# EAGLE design MainBoard_V5 (EAGLE 6.1)
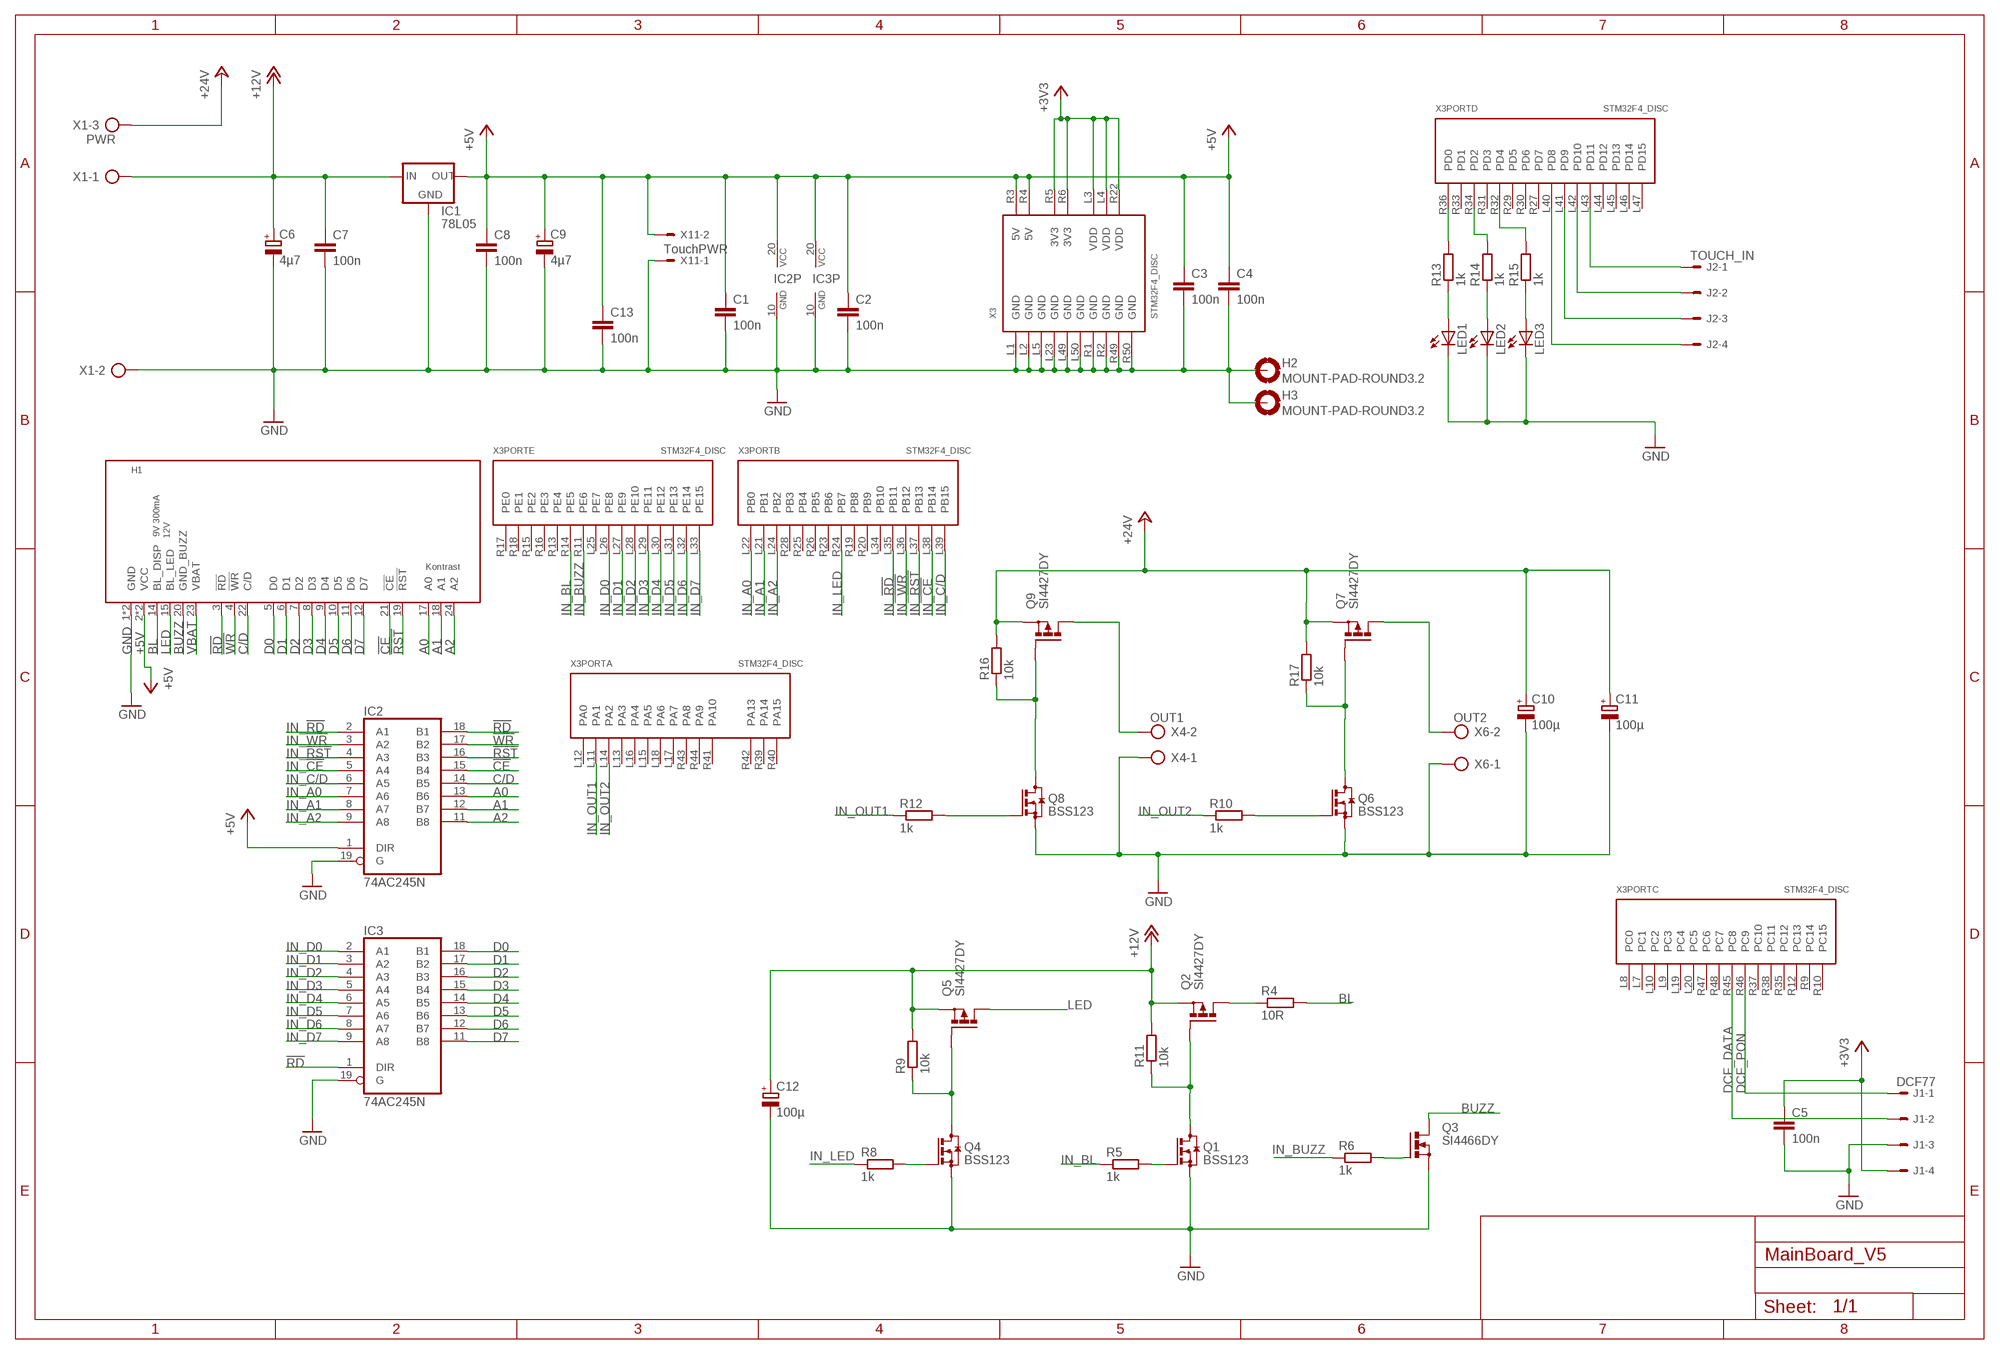
[diagram p0: schematic, sheet 1]

## Parts
C1  100n  C-EUC1206  [C1206]
C2  100n  C-EUC1206  [C1206]
C3  100n  C-EUC1206  [C1206]
C4  100n  C-EUC1206  [C1206]
C5  100n  C-EUC1206  [C1206]
C6  4µ7  CPOL-EUE2-5  [E2-5]
C7  100n  C-EUC1206  [C1206]
C8  100n  C-EUC1206  [C1206]
C9  4µ7  CPOL-EUE2-5  [E2-5]
C10  100µ  CPOL-EUE2-5  [E2-5]
C11  100µ  CPOL-EUE2-5  [E2-5]
C12  100µ  CPOL-EUE2-5  [E2-5]
C13  100n  C-EUC1206  [C1206]
H1  YL_24012-70-MICROMATCH  [YL24012-70-MICROMATCH]
H2  MOUNT-PAD-ROUND3.2  [3,2-PAD]
H3  MOUNT-PAD-ROUND3.2  [3,2-PAD]
IC1  78L05  78XXS  [78XXS]
IC2  74AC245N  [DIL20]
IC3  74AC245N  [DIL20]
J1  DCF77  22-27-2041-04  [6410-04]
J2  TOUCH_IN  22-27-2041-04  [6410-04]
LED1  LED3MM  [LED3MM]
LED2  LED3MM  [LED3MM]
LED3  LED3MM  [LED3MM]
Q1  BSS123  [SOT23]
Q2  SI4427DY  P-MOSFET-SO8  [SO-08]
Q3  SI4466DY  N-MOSFET-SO8S  [SO-08]
Q4  BSS123  [SOT23]
Q5  SI4427DY  P-MOSFET-SO8  [SO-08]
Q6  BSS123  [SOT23]
Q7  SI4427DY  P-MOSFET-SO8  [SO-08]
Q8  BSS123  [SOT23]
Q9  SI4427DY  P-MOSFET-SO8  [SO-08]
R4  10R  R-EU_0414/15  [0414/15]
R5  1k  R-EU_0207/10  [0207/10]
R6  1k  R-EU_R0805  [R0805]
R8  1k  R-EU_0207/10  [0207/10]
R9  10k  R-EU_0207/10  [0207/10]
R10  1k  R-EU_0207/10  [0207/10]
R11  10k  R-EU_0207/10  [0207/10]
R12  1k  R-EU_0207/10  [0207/10]
R13  1k  R-EU_0207/10  [0207/10]
R14  1k  R-EU_0207/10  [0207/10]
R15  1k  R-EU_0207/10  [0207/10]
R16  10k  R-EU_R1206  [R1206]
R17  10k  R-EU_R1206  [R1206]
X1  PWR  AK500/3  [AK500/3]
X3  STM32F4_DISC  [STM32F4_DISC]
X4  OUT1  AK500/2  [AK500/2]
X6  OUT2  AK500/2  [AK500/2]
X11  TouchPWR  22-23-2021  [22-23-2021]

## Nets
!CE: H1.21(!CE) IC2.15(B4)
!RD: H1.3(!RD) IC2.18(B1) IC3.1(DIR)
!RST: H1.19(!RST) IC2.16(B3)
!WR: H1.4(!WR) IC2.17(B2)
+3V3: C5.1 J1.4 X3.L3(VDD) X3.L4(VDD) X3.R5(3V3) X3.R6(3V3) X3.R22(VDD)
+5V: C1.1 C2.1 C3.1 C4.1 C8.1 C9.+ C13.1 H1.2(VCC) H1.16(VCC) IC1.OUT IC2.1(DIR) IC2.20(VCC) IC3.20(VCC) X3.R3(5V) X3.R4(5V) X11.2
+12V: C6.+ C7.1 C12.+ IC1.IN Q2.1(S) Q2.2(S) Q2.3(S) Q5.1(S) Q5.2(S) Q5.3(S) R9.2 R11.2 X1.1
+24V: C10.+ C11.+ Q7.1(S) Q7.2(S) Q7.3(S) Q9.1(S) Q9.2(S) Q9.3(S) R16.2 R17.2 X1.3
A0: H1.17(A0) IC2.13(B6)
A1: H1.18(A1) IC2.12(B7)
A2: H1.24(A2) IC2.11(B8)
BL: H1.14(BL_DISP) R4.2
BUZZ: H1.20(GND_BUZZ) Q3.5(D) Q3.6(D) Q3.7(D) Q3.8(D)
C/D: H1.22(C/D) IC2.14(B5)
D0: H1.5(D0) IC3.18(B1)
D1: H1.6(D1) IC3.17(B2)
D2: H1.7(D2) IC3.16(B3)
D3: H1.8(D3) IC3.15(B4)
D4: H1.9(D4) IC3.14(B5)
D5: H1.10(D5) IC3.13(B6)
D6: H1.11(D6) IC3.12(B7)
D7: H1.12(D7) IC3.11(B8)
DCF_DATA: J1.2 X3.R45(PC8)
DCF_PON: J1.1 X3.R46(PC9)
GND: C1.2 C2.2 C3.2 C4.2 C5.2 C6.- C7.2 C8.2 C9.- C10.- C11.- C12.- C13.2 H1.1(GND) H1.13(GND) H2.B3,2(MOUNT) H3.B3,2(MOUNT) IC1.GND IC2.10(GND) IC2.19(G) IC3.10(GND) IC3.19(G) J1.3 LED1.K(C) LED2.K(C) LED3.K(C) Q1.2(S) Q3.1(S) Q3.2(S) Q3.3(S) Q4.2(S) Q6.2(S) Q8.2(S) X1.2 X3.L1(GND) X3.L2(GND) X3.L5(GND) X3.L23(GND) X3.L49(GND) X3.L50(GND) X3.R1(GND) X3.R2(GND) X3.R49(GND) X3.R50(GND) X4.1 X6.1 X11.1
IN_!CE: IC2.5(A4) X3.L38(PB14)
IN_!RD: IC2.2(A1) X3.L35(PB11)
IN_!RST: IC2.4(A3) X3.L37(PB13)
IN_!WR: IC2.3(A2) X3.L36(PB12)
IN_A0: IC2.7(A6) X3.L22(PB0)
IN_A1: IC2.8(A7) X3.L21(PB1)
IN_A2: IC2.9(A8) X3.L24(PB2)
IN_BL: R5.1 X3.R14(PE5)
IN_BUZZ: R6.1 X3.R11(PE6)
IN_C/D: IC2.6(A5) X3.L39(PB15)
IN_D0: IC3.2(A1) X3.L26(PE8)
IN_D1: IC3.3(A2) X3.L27(PE9)
IN_D2: IC3.4(A3) X3.L28(PE10)
IN_D3: IC3.5(A4) X3.L29(PE11)
IN_D4: IC3.6(A5) X3.L30(PE12)
IN_D5: IC3.7(A6) X3.L31(PE13)
IN_D6: IC3.8(A7) X3.L32(PE14)
IN_D7: IC3.9(A8) X3.L33(PE15)
IN_LED: R8.1 X3.R24(PB7)
IN_OUT1: R12.1 X3.L11(PA1)
IN_OUT2: R10.1 X3.L14(PA2)
LED: H1.15(BL_LED) Q5.5(D) Q5.6(D) Q5.7(D) Q5.8(D)
N$1: R15.2 X3.R32(PD4)
N$2: R14.2 X3.R34(PD2)
N$3: J2.1 X3.L43(PD11)
N$4: Q1.3(D) Q2.4(G) R11.1
N$5: Q2.5(D) Q2.6(D) Q2.7(D) Q2.8(D) R4.1
N$6: Q1.1(G) R5.2
N$7: Q4.3(D) Q5.4(G) R9.1
N$8: Q3.4(G) R6.2
N$9: J2.2 X3.L42(PD10)
N$10: J2.3 X3.L41(PD9)
N$11: Q4.1(G) R8.2
N$12: Q6.3(D) Q7.4(G) R17.1
N$13: Q6.1(G) R10.2
N$14: J2.4 X3.L40(PD8)
N$15: Q8.3(D) Q9.4(G) R16.1
N$16: Q8.1(G) R12.2
N$17: LED1.A R13.1
N$18: LED2.A R14.1
N$19: LED3.A R15.1
N$28: R13.2 X3.R36(PD0)
OUT1: Q9.5(D) Q9.6(D) Q9.7(D) Q9.8(D) X4.2
OUT2: Q7.5(D) Q7.6(D) Q7.7(D) Q7.8(D) X6.2
VBAT: H1.23(VBAT)
Unconnected: X3.L6(!RST) X3.L7(PC1) X3.L8(PC0) X3.L9(PC3) X3.L10(PC2) X3.L12(PA0) X3.L13(PA3) X3.L15(PA5) X3.L16(PA4) X3.L17(PA7) X3.L18(PA6) X3.L19(PC4) X3.L20(PC5) X3.L25(PE7) X3.L34(PB10) X3.L44(PD12) X3.L45(PD13) X3.L46(PD14) X3.L47(PD15) X3.L48(NC) X3.R7(PH0) X3.R8(PH1) X3.R9(PC14) X3.R10(PC15) X3.R12(PC13) X3.R13(PE4) X3.R15(PE2) X3.R16(PE3) X3.R17(PE0) X3.R18(PE1) X3.R19(PB8) X3.R20(PB9) X3.R21(BOOT0) X3.R23(PB6) X3.R25(PB4) X3.R26(PB5) X3.R27(PD7) X3.R28(PB3) X3.R29(PD5) X3.R30(PD6) X3.R31(PD3) X3.R33(PD1) X3.R35(PC12) X3.R37(PC10) X3.R38(PC11) X3.R39(PA14) X3.R40(PA15) X3.R41(PA10) X3.R42(PA13) X3.R43(PA8) X3.R44(PA9) X3.R47(PC6) X3.R48(PC7) X3.T1(JP2A) X3.T2(JP2B) X3.T3(JP3A) X3.T4(JP3B)

## Library data of the parts
C1-C5 C7 C8 C13 = rcl:C-EU: CAPACITOR, European symbol
C6 C9-C12 = rcl:CPOL-EU: POLARIZED CAPACITOR, European symbol
H1 = GLCD-YL240:YL_24012-70-MICROMATCH
H2 H3 = holes:MOUNT-PAD-ROUND: MOUNTING PAD, round
IC1 = v-reg:78XXS: VOLTAGE REGULATOR
IC2 IC3 = 74xx-eu:74*245: Octal BUS TRANSCEIVER, 3-state
J1 J2 = con-molex:22-?-04: CONNECTOR wire to board 2.54 mm (.1 inch) pitch header; OC_FARNELL: unknown; OC_NEWARK: unknown
LED1-LED3 = led:LED: LED OSRAM: - CHIPLED LG R971, LG N971, LY N971, LG Q971, LY Q971, LO R971, LY R971 LH N974, LH R974 LS Q976, LO Q976, LY Q976 LO Q996 - Hyper CHIPLED LW Q18S LB Q993, LB Q99A, LB R99A - SideLED LS A670, LO A670, LY A670, LG A670, LP A670 LB A673, LV A673, LT A673, LW A673 LH A674 LY A675 LS A676, LA A676, LO A676, LY A676, LW A676 LS A679, LY A679, LG A679 - Hyper Micro SIDELED® LS Y876, LA Y876, LO Y876, LY Y876 LT Y87S - SmartLED LW L88C, LW L88S LB L89C, LB L89S, LG L890 LS L89K, LO L89K, LY L89K LS L896, LA L896, LO L896, LY L896 - TOPLED LS T670, LO T670, LY T670, LG T670, LP T670 LSG T670, LSP T670, LSY T670, LOP T670, LYG T670 LG T671, LOG T671, LSG T671 LB T673, LV T673, LT T673, LW T673 LH T674 LS T676, LA T676, LO T676, LY T676, LB T676, LH T676, LSB T676, LW T676 LB T67C, LV T67C, LT T67C, LS T67K, LO T67K, LY T67K, LW E67C LS E67B, LA E67B, LO E67B, LY E67B, LB E67C, LV E67C, LT E67C LW T67C LS T679, LY T679, LG T679 LS T770, LO T770, LY T770, LG T770, LP T770 LB T773, LV T773, LT T773, LW T773 LH T774 LS E675, LA E675, LY E675, LS T675 LS T776, LA T776, LO T776, LY T776, LB T776 LHGB T686 LT T68C, LB T68C - Hyper Mini TOPLED® LB M676 - Mini TOPLED Santana® LG M470 LS M47K, LO M47K, LY M47K Source: http://www.osram.convergy.de LUXEON: - LUMILED® LXK2-PW12-R00, LXK2-PW12-S00, LXK2-PW14-U00, LXK2-PW14-V00 LXK2-PM12-R00, LXK2-PM12-S00, LXK2-PM14-U00 LXK2-PE12-Q00, LXK2-PE12-R00, LXK2-PE12-S00, LXK2-PE14-T00, LXK2-PE14-U00 LXK2-PB12-K00, LXK2-PB12-L00, LXK2-PB12-M00, LXK2-PB14-N00, LXK2-PB14-P00, LXK2-PB14-Q00 LXK2-PR12-L00, LXK2-PR12-M00, LXK2-PR14-Q00, LXK2-PR14-R00 LXK2-PD12-Q00, LXK2-PD12-R00, LXK2-PD12-S00 LXK2-PH12-R00, LXK2-PH12-S00 LXK2-PL12-P00, LXK2-PL12-Q00, LXK2-PL12-R00 Source: www.luxeon.com KINGBRIGHT: KA-3528ASYC Source: www.kingbright.com
Q1 Q4 Q6 Q8 = transistor-small-signal:BSS123: N-CHANNEL MOS FET
Q2 Q5 Q7 Q9 = transistor-power:P-MOSFET-SO8: P-Channel MOSFET Example: FDS4435A; P-Channel Logic Level PowerTrench® MOSFET FDS4465; P-Channel 1.8V Specified PowerTrench® MOSFET Source: www.fairchildsemi.com
Q3 = transistor-power:N-MOSFET-SO8: N-Channel MOSFET Example: FDS7760A; N-Channel Logic Level PowerTrench® MOSFET FDS2572; N-Channel UltraFET® Trench MOSFET Source: www.fairchildsemi.com
R4-R6 R8-R17 = rcl:R-EU_: RESISTOR, European symbol
X1 = con-ptr500:AK500/3: CONNECTOR; OC_FARNELL: unknown; OC_NEWARK: unknown
X3 = stm32f4_disc:STM32F4_DISC: STM32F4 Discovery Board
X4 X6 = con-ptr500:AK500/2: CONNECTOR; OC_FARNELL: unknown; OC_NEWARK: unknown
X11 = con-molex:22-23-2021: .100" (2.54mm) Center Header - 2 Pin; MF: MOLEX; MPN: 22-23-2021; OC_FARNELL: 1462926; OC_NEWARK: 25C3832

## Board
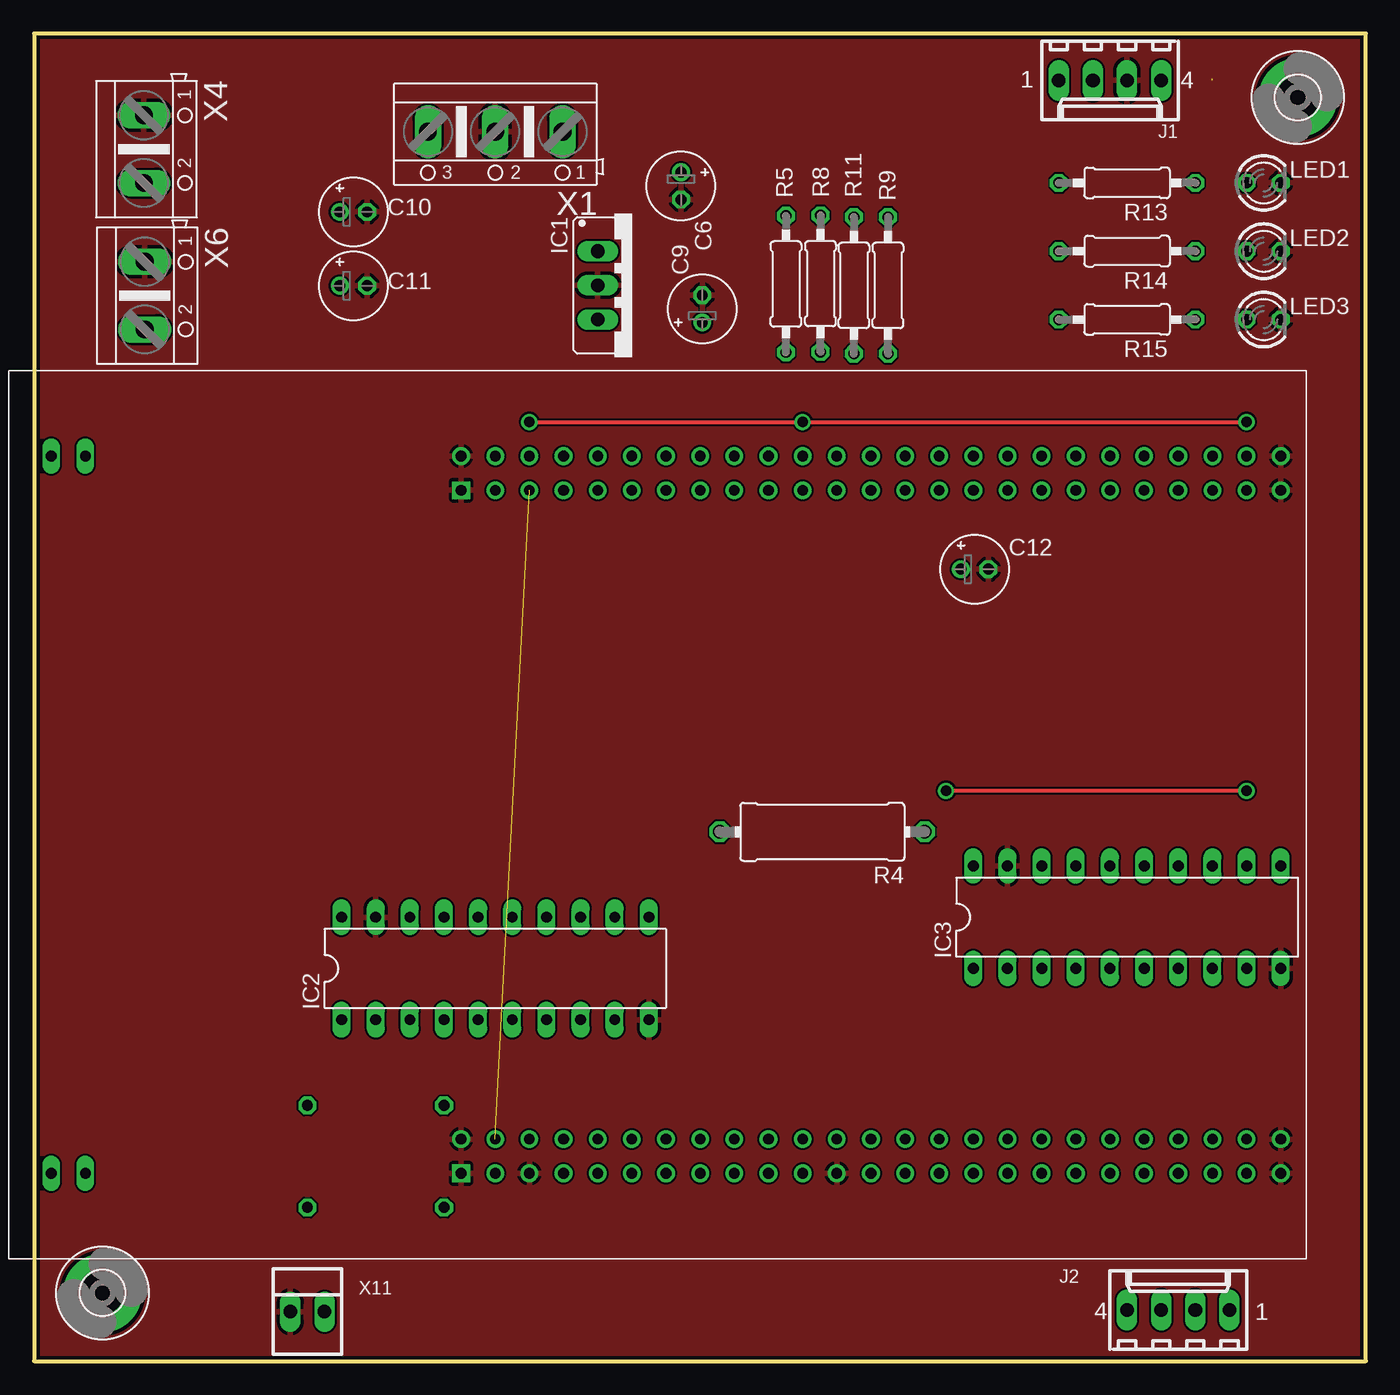
[diagram p1: board, top side]
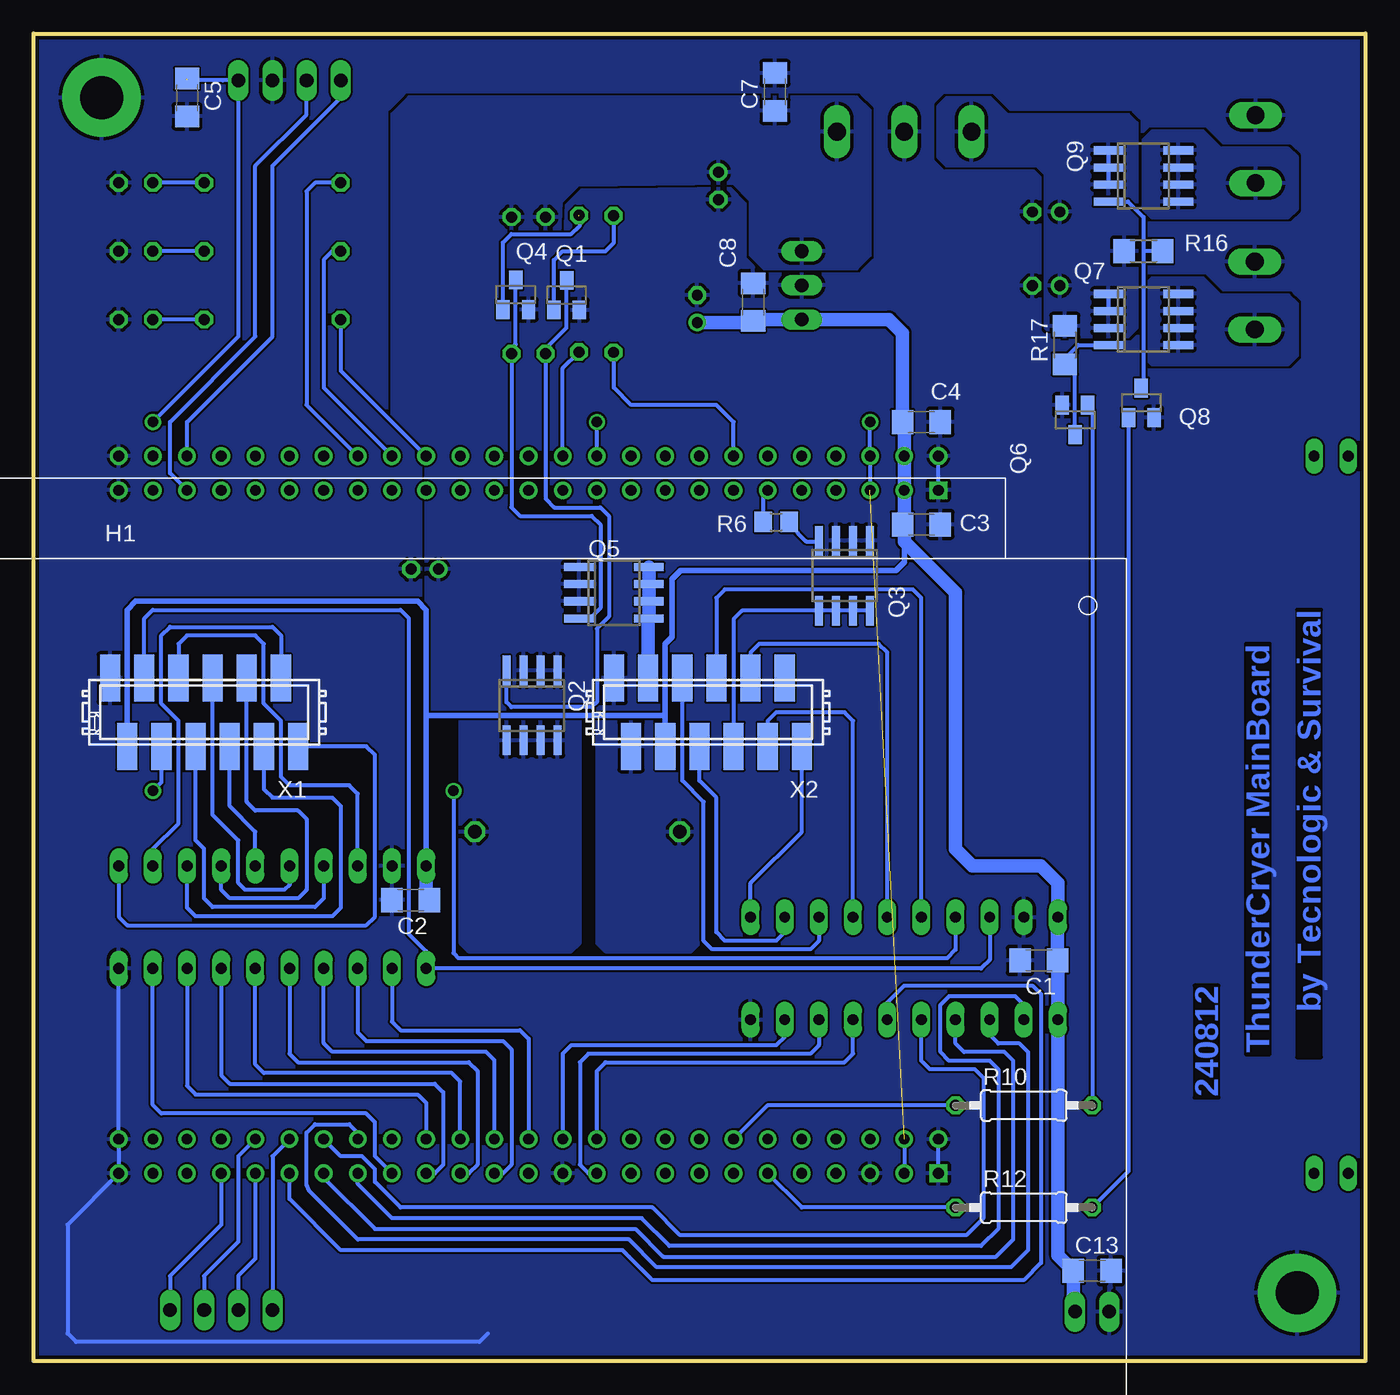
[diagram p2: board, bottom side, seen from below]

Size 99.04 x 98.73 mm. Coordinates in mm from the lower left corner, seen from the top.
Outline: 0,0 99.04,0 99.04,98.73 0,98.73 0,0
Copper layers (1*16): Top 0.035mm / dielectric 1.5mm / Bottom 0.035mm
Design rules: minimum track width 6mil, minimum drill 12mil, track to track 6mil, track to pad 6mil, pad to pad 6mil, via to via 6mil, smd to smd 0mil, copper to edge 10mil, drill to drill 10mil, minimum pad ring 10mil, minimum via ring 6mil, stop-mask expansion 2mil, vias tented up to drill 100mil, thermal gap 10mil

### Footprints (pad centres in the part's own frame; a part is rotated, then mirrored left to right if it is on the bottom)
C1206 = smd 1.6 x 1.8: 1 -1.4,0; 2 1.4,0
E2-5 = drill 0.813 pad 1.27: + -1.016,0 | drill 0.813 pad 1.27 octagon: - 1.016,0
YL24012-70-MICROMATCH = smd 1.5 x 3.5: 1 75.565,8.89; 2 74.295,13.97; 3 73.025,8.89; 4 71.755,13.97; 5 70.485,8.89; 6 69.215,13.97; 7 67.945,8.89; 8 66.675,13.97; 9 65.405,8.89; 10 64.135,13.97; 11 62.865,8.89; 12 61.595,13.97; 13 38.1,8.89; 14 36.83,13.97; 15 35.56,8.89; 16 34.29,13.97; 17 33.02,8.89; 18 31.75,13.97; 19 30.48,8.89; 20 29.21,13.97; 21 27.94,8.89; 22 26.67,13.97; 23 25.4,8.89; 24 24.13,13.97
3,2-PAD = drill 3.2 pad 5.842: B3,2 0,0
78XXS = drill 1.016 long: GND 0,-2.54; IN -2.54,-2.54; OUT 2.54,-2.54
DIL20 = drill 0.813 long: 1 -11.43,-3.81; 2 -8.89,-3.81; 3 -6.35,-3.81; 4 -3.81,-3.81; 5 -1.27,-3.81; 6 1.27,-3.81; 7 3.81,-3.81; 8 6.35,-3.81; 9 8.89,-3.81; 10 11.43,-3.81; 11 11.43,3.81; 12 8.89,3.81; 13 6.35,3.81; 14 3.81,3.81; 15 1.27,3.81; 16 -1.27,3.81; 17 -3.81,3.81; 18 -6.35,3.81; 19 -8.89,3.81; 20 -11.43,3.81
6410-04 = drill 1.016 long: 1 3.81,0; 2 1.27,0; 3 -1.27,0; 4 -3.81,0
LED3MM = drill 0.813 octagon: A -1.27,0; K 1.27,0
SOT23 = smd 1 x 1.4: 1 -0.95,-1.1; 2 0.95,-1.1; 3 0,1.1
SO-08 = smd 0.6 x 2.2: 1 -1.905,-2.6; 2 -0.635,-2.6; 3 0.635,-2.6; 4 1.905,-2.6; 5 1.905,2.6; 6 0.635,2.6; 7 -0.635,2.6; 8 -1.905,2.6
0414/15 = drill 1.016 octagon: 1 -7.62,0; 2 7.62,0
0207/10 = drill 0.813 octagon: 1 -5.08,0; 2 5.08,0
R0805 = smd 1.3 x 1.5: 1 -0.95,0; 2 0.95,0
R1206 = smd 1.6 x 1.803: 1 -1.422,0; 2 1.422,0
AK500/3 = drill 1.321 long: 1 -5.004,0; 2 0,0; 3 5.004,0
STM32F4_DISC = drill 0.8 square: L1 -27.94,30.48; R1 22.86,30.48 | drill 0.8: L2 -25.4,30.48; L3 -27.94,27.94; L4 -25.4,27.94; L5 -27.94,25.4; L6 -25.4,25.4; L7 -27.94,22.86; L8 -25.4,22.86; L9 -27.94,20.32; L10 -25.4,20.32; L11 -27.94,17.78; L12 -25.4,17.78; L13 -27.94,15.24; L14 -25.4,15.24; L15 -27.94,12.7; L16 -25.4,12.7; L17 -27.94,10.16; L18 -25.4,10.16; L19 -27.94,7.62; L20 -25.4,7.62; L21 -27.94,5.08; L22 -25.4,5.08; L23 -27.94,2.54; L24 -25.4,2.54; L25 -27.94,0; L26 -25.4,0; L27 -27.94,-2.54; L28 -25.4,-2.54; L29 -27.94,-5.08; L30 -25.4,-5.08; L31 -27.94,-7.62; L32 -25.4,-7.62; L33 -27.94,-10.16; L34 -25.4,-10.16; L35 -27.94,-12.7; L36 -25.4,-12.7; L37 -27.94,-15.24; L38 -25.4,-15.24; L39 -27.94,-17.78; L40 -25.4,-17.78; L41 -27.94,-20.32; L42 -25.4,-20.32; L43 -27.94,-22.86; L44 -25.4,-22.86; L45 -27.94,-25.4; L46 -25.4,-25.4; L47 -27.94,-27.94; L48 -25.4,-27.94; L49 -27.94,-30.48; L50 -25.4,-30.48; R2 25.4,30.48; R3 22.86,27.94; R4 25.4,27.94; R5 22.86,25.4; R6 25.4,25.4; R7 22.86,22.86; R8 25.4,22.86; R9 22.86,20.32; R10 25.4,20.32; R11 22.86,17.78; R12 25.4,17.78; R13 22.86,15.24; R14 25.4,15.24; R15 22.86,12.7; R16 25.4,12.7; R17 22.86,10.16; R18 25.4,10.16; R19 22.86,7.62; R20 25.4,7.62; R21 22.86,5.08; R22 25.4,5.08; R23 22.86,2.54; R24 25.4,2.54; R25 22.86,0; R26 25.4,0; R27 22.86,-2.54; R28 25.4,-2.54; R29 22.86,-5.08; R30 25.4,-5.08; R31 22.86,-7.62; R32 25.4,-7.62; R33 22.86,-10.16; R34 25.4,-10.16; R35 22.86,-12.7; R36 25.4,-12.7; R37 22.86,-15.24; R38 25.4,-15.24; R39 22.86,-17.78; R40 25.4,-17.78; R41 22.86,-20.32; R42 25.4,-20.32; R43 22.86,-22.86; R44 25.4,-22.86; R45 22.86,-25.4; R46 25.4,-25.4; R47 22.86,-27.94; R48 25.4,-27.94; R49 22.86,-30.48; R50 25.4,-30.48 | drill 0.8 long: T1 -27.94,60.96; T2 -27.94,58.42; T3 25.4,60.96; T4 25.4,58.42
AK500/2 = drill 1.321 long: 1 -2.515,0; 2 2.515,0
22-23-2021 = drill 1 long: 1 -1.27,0; 2 1.27,0

### Placement (x,y rotation side)
C1  24.29,29.81 180 bottom
C2  70.99,34.29 180 bottom
C3  33.02,62.23 0 bottom
C4  33.02,69.85 0 bottom
C5  87.63,93.98 270 bottom
C6  48.1,87.41 270 top
C7  43.91,94.39 90 bottom
C8  45.53,78.77 90 bottom
C9  49.69,78.26 90 top
C10  23.75,85.47 0 top
C11  23.75,79.98 0 top
C12  69.95,58.9 0 top
C13  20.32,6.73 0 bottom
H1  17.78,59.69 180 bottom
H2  5.08,5.08 0 top
H3  93.98,93.98 0 top
IC1  44.45,80.01 270 top
IC2  34.29,29.21 0 top
IC3  81.28,33.02 0 top
J1  80.01,95.25 180 top
J2  85.09,3.81 0 top
LED1  91.44,87.63 0 top
LED2  91.44,82.55 0 top
LED3  91.44,77.47 0 top
Q1  59.4,79.28 0 bottom
Q2  61.98,48.77 180 bottom
Q3  38.73,58.42 180 bottom
Q4  63.18,79.31 0 bottom
Q5  55.88,57.15 270 bottom
Q6  21.59,70.01 180 bottom
Q7  16.51,77.47 270 bottom
Q8  16.67,71.28 0 bottom
Q9  16.51,88.14 270 bottom
R4  58.61,39.37 180 top
R5  55.91,80.11 90 top
R6  43.81,62.42 0 bottom
R8  58.48,80.14 90 top
R9  63.5,80.01 90 top
R10  25.4,19.02 0 bottom
R11  60.96,80.01 90 top
R12  25.4,11.43 0 bottom
R13  81.28,87.63 180 top
R14  81.28,82.55 180 top
R15  81.28,77.47 180 top
R16  16.51,82.55 180 bottom
R17  22.35,75.56 90 bottom
X1  34.29,91.44 180 top
X3  62.23,41.91 90 top
X4  8.16,90.14 270 top
X6  8.22,79.25 270 top
X11  20.32,3.68 0 top

### Tracks (layer width: path | path; a pad name or v marks a point on that pad's centre or on a via)
!CE
  Bottom 0.305: IC2.15 35.56,52.7 36.2,53.34 45.09,53.34 45.72,52.7 H1.21
!RD
  Bottom 0.305: IC2.18 27.94,29.84 28.57,29.21 IC3.1 69.85,30.48 71.12,31.75 71.12,55.24 71.75,55.88 90.17,55.88 90.81,55.24 H1.3
!RST
  Bottom 0.305: IC2.16 33.02,56.77 33.66,57.4 47.62,57.4 48.26,56.77 H1.19
!WR  (via drill 0.8 pad 1.02)
  Top 0.305: v90.17,42.42 v67.82,42.42
  Bottom 0.305: IC2.17 30.48,30.61 31.11,29.97 67.44,29.97 67.82,30.35 v67.82,42.42 | H1.4 89.53,43.05 v90.17,42.42
+3V3  (via drill 0.8)  (2 unrouted)
  Top 0.305: v36.83,69.85 v57.15,69.85 v90.17,69.85
  Bottom 0.305: X3.R5 X3.R6 v36.83,69.85 | v90.17,69.85 83.82,76.2 J1.4 84.96,95.25 87.63,95.25 | X3.L4 X3.L3 | X3.R22 v57.15,69.85
+5V
  Bottom 0.305: 34.29,69.72 C4.1 | 22.86,29.79 C1.1 | 22.89,32.99 IC2.20 | 34.29,62.36 C3.1 34.29,62.23 | 69.85,34.29 C2.1 | 45.94,77.25 45.65,77.25 C8.1
  Bottom 0.406: H1.2 92.08,55.88 91.44,56.52 70.48,56.52 69.85,55.88 69.85,48.01 | 69.85,48.01 IC3.20 | H1.16 52.07,48.01 | 34.29,60.96 34.29,59.44 34.92,58.8 50.93,58.8 51.56,58.17 51.56,53.85 52.07,53.34 52.07,48.01 | 52.07,48.01 69.85,48.01
  Bottom 1.016: 34.29,69.72 X3.R4 X3.R3 34.29,62.36 | IC3.20 69.85,34.29 | 22.86,29.79 IC2.1 22.86,7.87 C13.1 21.72,3.81 X11.2 | C1.1 22.89,32.99 | IC2.20 22.86,35.56 24.13,36.83 29.21,36.83 30.48,38.1 30.48,57.15 34.29,60.96 34.29,62.23 | 45.94,77.25 C9.+ | C4.1 34.42,76.47 35.42,77.47 IC1.OUT 45.72,77.47 45.62,77.37 C8.1
+12V
  pour Bottom (rank 3): 57.15,48.9 57.15,60.33 57.78,60.96 69.22,60.96 69.85,60.33 69.85,48.9 69.22,48.26 57.78,48.26
  pour Bottom (rank 3): 36.83,82.28 36.83,92.98 37.83,93.98 44.72,93.98 45.72,92.98 45.72,82.28 44.72,81.28 37.83,81.28
  pour Bottom (rank 5): 44.45,93.98 71.12,93.98 72.39,92.71 72.39,69.85 69.85,67.31 69.85,59.69 57.15,59.69 57.15,62.23 58.42,63.5 62.23,63.5 63.5,64.77 63.5,73.66 63.25,77.85 64.14,78.74 64.14,83.06 63.5,83.69 63.5,83.82 59.94,83.82 59.82,86.23 58.55,87.5 46.99,87.63 45.72,86.36
+24V
  Bottom 0.305: Q9.3 Q9.2 Q9.1 | Q7.1 Q7.2
  pour Bottom (rank 3): 26.67,92.71 17.65,92.71 17.02,92.08 17.02,76.83 17.65,76.2 23.11,76.2 23.75,76.83 23.75,88.27 24.38,88.9 31.11,88.9 31.75,89.53 31.75,93.34 31.11,93.98 27.94,93.98
A0
  Bottom 0.305: IC2.13 40.64,31.27 41.27,30.64 48.58,30.64 49.21,31.27 49.21,41.59 50.8,43.18 H1.17
A1
  Bottom 0.305: IC2.12 43.18,31.91 43.81,31.27 47.62,31.27 48.26,31.91 48.26,41.91 49.53,43.18 H1.18
A2
  Bottom 0.305: IC2.11 45.72,35.56 41.91,39.37 H1.24
BL
  pour Bottom (rank 3): 50.16,48.26 56.52,48.26 57.15,47.62 57.15,31.11 56.52,30.48 50.16,30.48 49.53,31.11 49.53,47.62
BUZZ
  Bottom 0.305: Q3.8 Q3.7 Q3.6 Q3.5 46.35,55.82 46.99,55.19 H1.20
C/D
  Bottom 0.305: IC2.14 38.1,47.62 38.73,48.26 43.81,48.26 44.45,47.62 H1.22
D0
  Bottom 0.305: IC3.18 74.93,42.2 75.56,42.83 80.01,42.83 80.64,43.47 80.64,47.62 81.92,48.9 81.92,53.34 82.55,53.98 87.63,53.98 88.27,53.34 H1.5
D1
  Bottom 0.305: IC3.17 77.47,34.42 78.11,33.78 85.72,33.78 86.36,34.42 86.36,38.1 87,38.73 H1.6
D2
  Bottom 0.305: IC3.16 80.01,35.43 80.39,35.05 83.31,35.05 83.82,35.56 83.82,38.73 85.72,40.64 H1.7
D3
  Bottom 0.305: IC3.15 82.55,39.37 84.45,41.27 H1.8
D4
  Bottom 0.305: IC3.14 85.09,35.05 84.45,34.42 79.38,34.42 78.74,35.05 78.74,40.32 79.38,40.96 82.55,40.96 83.19,41.59 H1.9
D5
  Bottom 0.305: H1.10 81.92,42.55 81.28,41.91 76.83,41.91 76.2,41.27 76.2,33.72 76.83,33.08 87,33.08 87.63,33.72 IC3.13
D6
  Bottom 0.305: IC3.12 90.17,38.1 88.27,40.01 88.27,47.62 89.53,48.9 89.53,53.98 88.9,54.61 81.28,54.61 80.64,53.98 H1.11
D7
  Bottom 0.305: IC3.11 92.71,33.05 92.08,32.42 74.3,32.42 73.66,33.05 73.66,45.09 74.3,45.72 H1.12 79.53,45.72
DCF_DATA
  Bottom 0.305: X3.R45 88.9,66.04 88.9,69.85 82.55,76.2 82.55,88.9 78.74,92.71 J1.2
DCF_PON
  Bottom 0.305: X3.R46 87.63,69.85 81.28,76.2 81.28,88.9 76.2,93.98 J1.1
GND
  Bottom 0.305: X3.L1 X3.L2 | X3.R1 X3.R2 | IC3.10 X3.L50 X3.L49 96.52,10.16 96.52,2.06 95.89,1.43 65.88,1.43 65.25,2.06
  pour Bottom (rank 6): 0,99.06 99.06,99.06 99.06,0 0,0
  pour Top: 0,99.06 99.06,99.06 99.06,0 0,0
IN_!CE
  Bottom 0.305: X3.L38 76.2,15.24 74.61,15.24 73.66,14.29 73.66,13.34 71.75,11.43 53.02,11.43 50.96,9.37 29.69,9.37 28.42,10.64 28.42,21.08 29.05,21.72 32.38,21.72 33.02,22.35 IC2.5
IN_!RD
  Bottom 0.305: IC2.2 25.4,26.51 26.04,27.15 30.96,27.15 31.59,26.51 31.59,22.99 30.96,22.35 27.94,22.35 27.3,21.72 27.3,9.84 28.57,8.57 51.75,8.57 53.82,10.64 72.39,10.64 74.93,13.18 X3.L35
IN_!RST
  Bottom 0.305: X3.L37 77.47,13.65 73.66,9.84 54.29,9.84 52.23,7.78 27.46,7.78 26.19,9.05 26.19,22.35 26.83,22.99 29.84,22.99 30.48,23.62 IC2.4
IN_!WR
  Bottom 0.305: X3.L36 74.93,16.99 75.56,17.62 78.11,17.62 78.74,16.99 78.74,13.12 78.55,12.67 74.93,9.05 54.77,9.05 52.7,6.99 26.35,6.99 25.08,8.26 25.08,22.99 25.72,23.62 27.3,23.62 27.94,24.26 IC2.3
IN_A0
  Bottom 0.305: X3.L22 57.15,21.59 56.52,22.23 38.73,22.23 38.1,22.86 IC2.7
IN_A1
  Bottom 0.305: IC2.8 40.64,23.5 41.27,22.86 57.78,22.86 58.42,22.23 58.42,14.61 57.78,13.97 X3.L21
IN_A2
  Bottom 0.305: IC2.9 43.18,24.13 43.81,23.5 59.05,23.5 59.69,22.86 X3.L24
IN_BL
  Bottom 0.305: X3.R14 46.99,69.85 48.26,71.12 54.61,71.12 55.88,72.39 55.88,74.99 R5.1
IN_BUZZ
  Bottom 0.305: R6.1 44.77,64.45 X3.R11
IN_C/D
  Bottom 0.305: IC2.6 35.56,26.67 34.29,27.94 24.77,27.94 24.13,27.3 24.13,7.3 25.4,6.03 53.02,6.03 55.24,8.26 76.2,8.26 80.01,12.06 X3.L39
IN_D0
  Bottom 0.305: IC3.2 72.39,25.24 71.75,24.61 62.87,24.61 62.23,23.97 X3.L26
IN_D1
  Bottom 0.305: IC3.3 74.93,24.45 74.3,23.81 64.14,23.81 63.5,23.18 63.5,14.61 64.14,13.97 X3.L27
IN_D2
  Bottom 0.305: X3.L28 64.77,22.38 65.41,23.02 76.83,23.02 77.47,23.65 IC3.4
IN_D3
  Bottom 0.305: IC3.5 80.01,22.86 79.38,22.23 66.67,22.23 66.04,21.59 66.04,14.61 66.67,13.97 X3.L29
IN_D4
  Bottom 0.305: X3.L30 67.31,20.8 67.94,21.43 81.92,21.43 82.55,22.07 IC3.6
IN_D5
  Bottom 0.305: IC3.7 85.09,21.27 84.45,20.64 69.22,20.64 68.58,20 68.58,14.61 69.22,13.97 X3.L31
IN_D6
  Bottom 0.305: IC3.8 87.63,20.48 87,19.84 70.48,19.84 69.85,19.21 X3.L32
IN_D7
  Bottom 0.305: X3.L33 73.66,15.24 73.66,17.78 74.3,18.41 89.53,18.41 90.17,19.05 IC3.9
IN_LED
  Bottom 0.305: X3.R24 59.69,73.85 R8.1
IN_OUT1
  Bottom 0.305: X3.L11 41.91,11.43 R12.1
IN_OUT2
  Bottom 0.305: R10.1 44.48,19.02 X3.L14
LED
  Bottom 0.305: 53.34,55.19 Q5.5
  Bottom 1.016: H1.15 53.34,55.19 | Q5.5 Q5.6 Q5.7 Q5.8
N$1
  Bottom 0.305: R15.2 76.2,73.66 X3.R32
N$2
  Bottom 0.305: R14.2 76.83,82.55 77.47,81.92 77.47,72.39 X3.R34
N$3
  Bottom 0.305: X3.L43 85.09,10.16 88.9,6.35 J2.1
N$4
  Bottom 0.305: Q1.3 59.44,80.35 59.44,76.83 61.34,74.93 R11.1 60.96,64.14 60.33,63.5 56.9,63.5 56.26,62.87 56.26,55.37 57.15,54.48 57.15,49.02 57.53,48.64 63.5,48.64 63.88,49.02 Q2.4 63.88,51.44
N$5
  pour Bottom (rank 4): 59.05,48.26 66.67,48.26 67.31,47.62 67.31,31.11 66.67,30.48 59.05,30.48 58.42,31.11 58.42,47.62
N$6
  Bottom 0.305: Q1.1 60.35,81.89 59.69,82.55 56.52,82.55 55.88,83.19 55.88,85.09 55.91,85.12 R5.2
N$7
  Bottom 0.305: Q5.4 57.66,55.24 56.9,56.01 56.9,62.23 57.53,62.87 62.87,62.87 63.5,63.5 R9.1 63.5,75.31 63.18,75.63 Q4.3
N$8
  Bottom 0.305: R6.2 42.23,61.59 41.59,60.96 40.64,60.96 Q3.4
N$9
  Bottom 0.305: X3.L42 83.82,15.24 83.82,8.89 86.36,6.35 J2.2
N$10
  Bottom 0.305: X3.L41 82.55,7.62 83.82,6.35 J2.3
N$11  (1 unrouted)
  Bottom 0.305: Q4.1 64.13,83.19 63.5,83.82 59.05,83.82 58.42,84.45 58.42,85.09 58.48,85.15
N$12
  Bottom 0.305: 22.86,73.64 R17.1 | R17.1 22.35,74.56 21.35,75.56 Q7.4 | Q6.3 21.59,73.38 R17.1
N$13
  Bottom 0.305: R10.2 20.32,70.79 Q6.1
N$14
  Bottom 0.305: X3.L40 81.28,15.24 J2.4
N$15
  Bottom 0.305: Q9.4 17.65,86.23 16.51,85.09 16.51,82.55 | R16.1 16.51,82.55 | 16.51,82.55 16.51,72.54 Q8.3
N$16
  Bottom 0.305: Q8.1 17.62,14.13 R12.2
N$17
  Bottom 0.305: R13.1 LED1.A
N$18
  Bottom 0.305: R14.1 LED2.A
N$19
  Bottom 0.305: R15.1 LED3.A
N$28
  Bottom 0.305: R13.2 78.11,87.63 78.74,87 78.74,71.12 X3.R36
OUT1
  pour Bottom (rank 5): 5.71,90.17 10.79,90.17 12.06,91.44 15.88,91.44 16.51,90.81 16.51,85.72 15.88,85.09 5.71,85.09 5.08,85.72 5.08,89.53
  pour Bottom (rank 3): 5.71,90.17 10.79,90.17 12.06,91.44 15.88,91.44 16.51,90.81 16.51,85.72 15.88,85.09 5.71,85.09 5.08,85.72 5.08,89.53
OUT2
  pour Bottom (rank 3): 5.71,79.25 10.79,79.25 12.06,80.52 15.88,80.52 16.51,79.88 16.51,74.8 15.88,74.17 5.71,74.17 5.08,74.8 5.08,78.61

### Text on the board
Bottom: by Tecnologic & Survival | ThunderCryer MainBoard | 240812